# Altium schematic sheet SD Card and Debug Uart.SchDoc
size A4; SheetNumber: 16; SheetTotal: 26
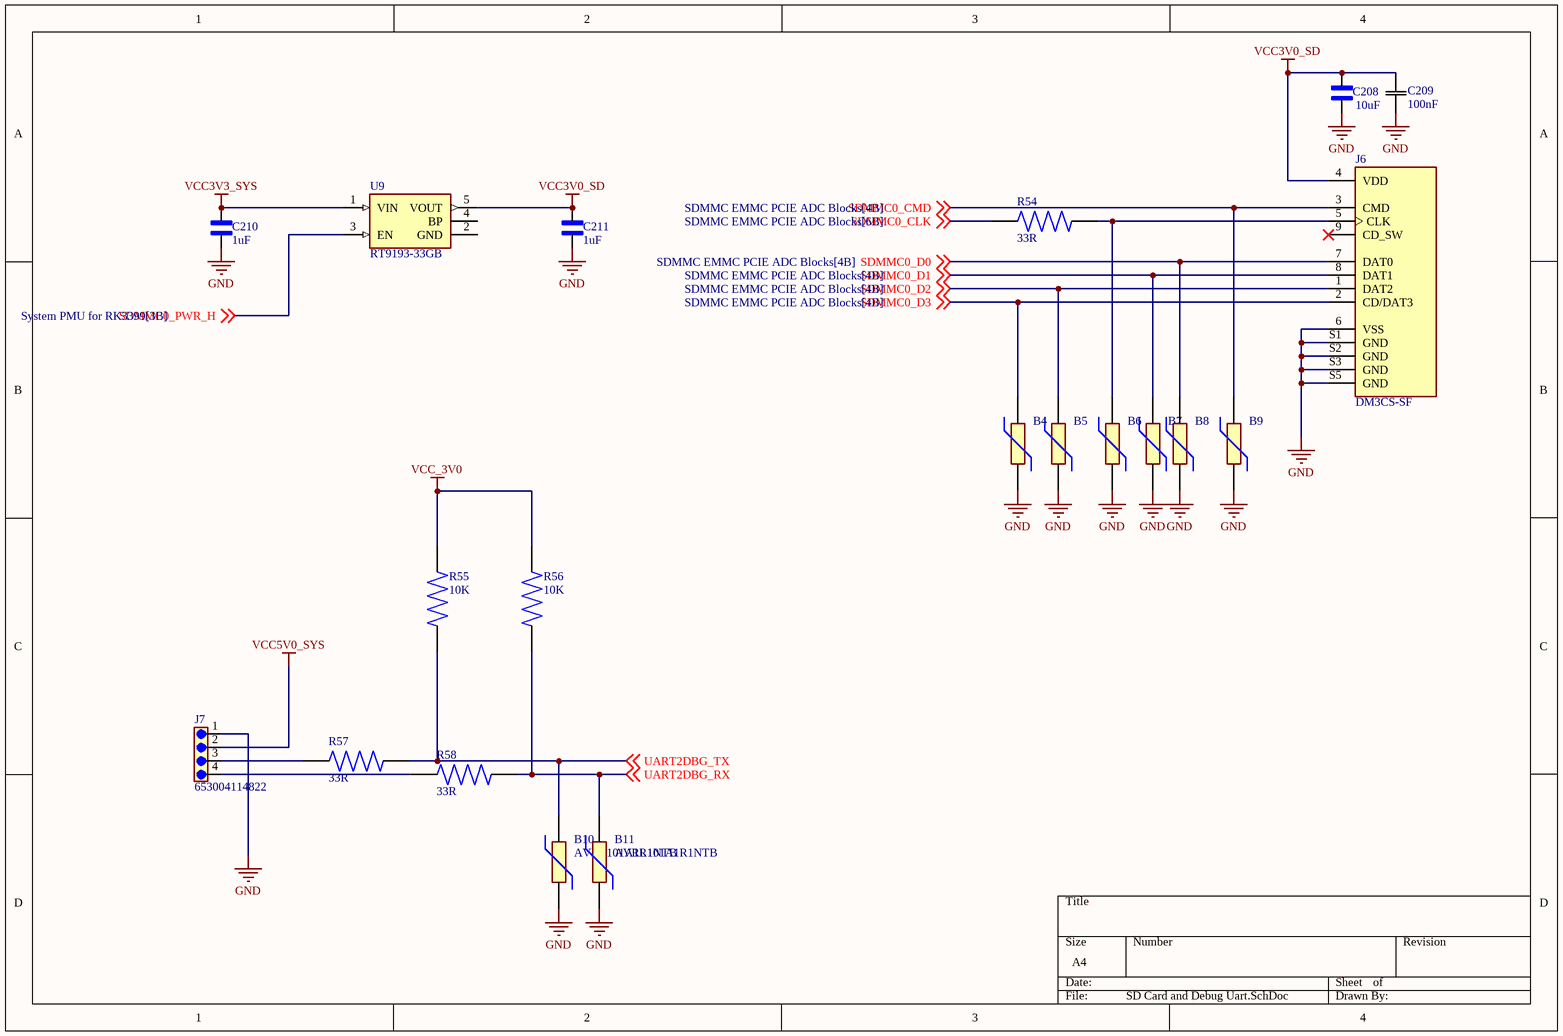
[diagram p0: SD Card and Debug Uart.SchDoc]

## Parts
B4  (no value)  [VARC1005X55N]
B5  (no value)  [VARC1005X55N]
B6  (no value)  [VARC1005X55N]
B7  (no value)  [VARC1005X55N]
B8  (no value)  [VARC1005X55N]
B9  (no value)  [VARC1005X55N]
B10  AVRL101A1R1NTB  [VARC1005X55N]
B11  AVRL101A1R1NTB  [VARC1005X55N]
C208  10uF  [CAPC1005X70N]
C209  100nF  [CAP_1005_TDK]
C210  1uF  [CAPC1005X56N]
C211  1uF  [CAPC1005X56N]
J6  DM3CS-SF  [HRS_DM3CS-SF]
J7  653004114822  [653004114822]
R54  33R  [RES_ERA6AHD330V]
R55  10K  [RES_ERA3ARB103V]
R56  10K  [RES_ERA3ARB103V]
R57  33R  [RES_ERA6AHD330V]
R58  33R  [RES_ERA6AHD330V]
U9  RT9193-33GB  [SOT94P279X129-5N]

## Nets
GND: B4.1 B5.1 B6.1 B7.1 B8.1 B9.1 B10.1 B11.1 C208.1 C209.1 C210.1 C211.1 J6.6(VSS) J6.S1(GND) J6.S2(GND) J6.S3(GND) J6.S5(GND) J7.1
VCC3V0_SD: C208.2 C209.2 C211.2 J6.4(VDD) U9.5(VOUT)
VCC3V3_SYS: C210.2 U9.1(VIN)
VCC5V0_SYS: J7.2
VCC_3V0: R55.2 R56.2
SDMMC0_CLK: R54.1 ; off-sheet SDMMC0_CLK
SDMMC0_CMD: B9.2 J6.3(CMD) ; off-sheet SDMMC0_CMD
SDMMC0_D0: B8.2 J6.7(DAT0) ; off-sheet SDMMC0_D0
SDMMC0_D1: B7.2 J6.8(DAT1) ; off-sheet SDMMC0_D1
SDMMC0_D2: B5.2 J6.1(DAT2) ; off-sheet SDMMC0_D2
SDMMC0_D3: B4.2 J6.2(CD/DAT3) ; off-sheet SDMMC0_D3
SDMMC0_PWR_H: U9.3(EN) ; off-sheet SDMMC0_PWR_H
UART2DBG_RX: B11.2 R56.1 R58.2 ; off-sheet UART2DBG_RX
UART2DBG_TX: B10.2 R55.1 R57.2 ; off-sheet UART2DBG_TX
NetB6_2: B6.2 J6.5(CLK) R54.2
NetJ7_3: J7.3 R57.1
NetJ7_4: J7.4 R58.1

Not connected (* = marked no-connect by the designer): J6 9(CD_SW)*; U9 2(GND) 4(BP)

## Library data of the parts
B4-B11 = AVRL101A1R1NTB: Chip Varistors / Ceramic Transient Voltage Suppressors, Maximum continuous voltage [DC]=10V, Capacitance = 1.1pF; Manufacturer_Name: TDK; Geometry.Height: 0.55mm; Manufacturer_Part_Number: AVRL101A1R1NTB; Mouser Part Number: 810-AVRL101A1R1NTB; Mouser Price/Stock: https://www.mouser.co.uk/ProductDetail/TDK/AVRL101A1R1NTB?qs=pr9f6yweEOGaWR8G2rllTw%3D%3D; Arrow Part Number: AVRL101A1R1NTB; Arrow Price/Stock: https://www.arrow.com/en/products/avrl101a1r1ntb/tdk?utm_currency=USD&region=europe; Datasheet Link: https://product.tdk.com/system/files/dam/doc/product/protection/voltage/varistor_ctvs/catalog/vpd_varistors_avr_en.pdf
C208 = CL05A106MQ5NUNC: 10 ÂµF Â±20% 6.3V Ceramic Capacitor X5R 0402 (1005 Metric); MF: Samsung; SnapEDA_Link: https://www.snapeda.com/parts/CL05A106MQ5NUNC/Samsung/view-part/?ref=snap; Package: SMD-2 Samsung; Value: *; MP: CL05A106MQ5NUNC; Check_prices: https://www.snapeda.com/parts/CL05A106MQ5NUNC/Samsung/view-part/?ref=eda
C209 = C1005X7R1H104M050BB: Description; Manufacturer_Name: TDK; Copyright: Copyright (C) 2025 Ultra Librarian. All rights reserved.; Manufacturer_Part_Number: C1005X7R1H104M050BB
C210 C211 = 0402ZD105KAT4A: 1 ÂµF Â±10% 10V Ceramic Capacitor X5R 0402 (1005 Metric); MF: AVX; SnapEDA_Link: https://www.snapeda.com/parts/0402ZD105KAT4A/AVX/view-part/?ref=snap; Package: 1005 AVX; Value: *; MP: 0402ZD105KAT4A; Check_prices: https://www.snapeda.com/parts/0402ZD105KAT4A/AVX/view-part/?ref=eda
J6 = DM3CS-SF: 10 (8 + 2) Position Card Connector Secure Digital - microSDâ„¢ Surface Mount, Right Angle Gold; MF: Hirose Electric Co Ltd; SnapEDA_Link: https://www.snapeda.com/parts/DM3CS-SF/Hirose+Electric+Co+Ltd/view-part/?ref=snap; Package: None; Value: *; MP: DM3CS-SF; Check_prices: https://www.snapeda.com/parts/DM3CS-SF/Hirose+Electric+Co+Ltd/view-part/?ref=eda
J7 = 653004114822: CONN, HEADER, 4POS, 1ROW, 1.25MM ROHS COMPLIANT: YES; MF: WÃ¼rth Elektronik; SnapEDA_Link: https://www.snapeda.com/parts/653004114822/W%25C3%25BCrth+Elektronik+Midcom/view-part/?ref=snap; Package: None; Value: *; MP: 653004114822; Check_prices: https://www.snapeda.com/parts/653004114822/W%25C3%25BCrth+Elektronik+Midcom/view-part/?ref=eda
R54 R57 R58 = ERA6AHD330V: Package: None; MP: ERA6AHD330V; Price: None; Value: *; Availability: Unavailable
R55 R56 = ERA3ARB103V: MP: ERA3ARB103V; Availability: Unavailable; Package: None; Value: *; Price: None
U9 = RT9193-33GB: Linear Voltage Regulator IC Positive Fixed 1 Output 300mA TSOT-23-5; MF: Richtek USA; SnapEDA_Link: https://www.snapeda.com/parts/RT9193-33GB/Richtek+USA+Inc./view-part/?ref=snap; Package: SOT-23-5 Richtek; MP: RT9193-33GB; Check_prices: https://www.snapeda.com/parts/RT9193-33GB/Richtek+USA+Inc./view-part/?ref=eda; Purchase-URL: https://pricing.snapeda.com/search/part/RT9193-33GB/?ref=eda; Digi-Key_Part_Number: 1028-1014-2-ND; Value: *